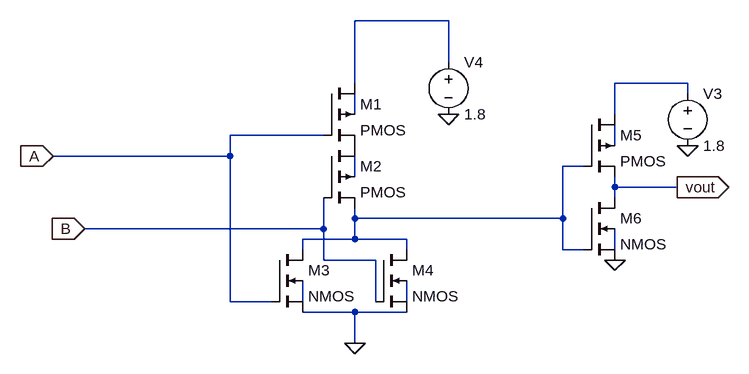
[diagram p0: schematic OR_Static.asc]
OR_Static.asc, the LTspice schematic file:
Version 4
SHEET 1 880 680
WIRE 304 -64 160 -64
WIRE 304 0 304 -64
WIRE 160 32 160 -64
WIRE 672 32 560 32
WIRE 672 48 672 32
WIRE 160 80 160 48
WIRE 560 80 560 32
WIRE 112 112 -32 112
WIRE 560 128 560 96
WIRE -32 144 -32 112
WIRE -32 144 -304 144
WIRE 512 160 480 160
WIRE 160 176 160 144
WIRE 560 192 560 176
WIRE 656 192 560 192
WIRE 560 208 560 192
WIRE 160 240 160 224
WIRE 480 240 480 160
WIRE 480 240 160 240
WIRE 112 256 112 208
WIRE 112 256 -256 256
WIRE 160 272 160 240
WIRE 160 272 80 272
WIRE 240 272 160 272
WIRE 80 288 80 272
WIRE 240 288 240 272
WIRE 480 288 480 240
WIRE 512 288 480 288
WIRE 560 288 560 256
WIRE 112 304 112 256
WIRE 192 304 112 304
WIRE -32 368 -32 144
WIRE 32 368 -32 368
WIRE 80 368 80 336
WIRE 192 368 192 304
WIRE 240 368 240 336
WIRE 160 384 80 384
WIRE 240 384 160 384
WIRE 160 432 160 384
FLAG 160 432 0
FLAG 560 304 0
FLAG 672 128 0
FLAG 304 80 0
FLAG 656 192 vout
IOPIN 656 192 Out
FLAG -304 144 A
IOPIN -304 144 In
FLAG -256 256 B
IOPIN -256 256 In
SYMBOL pmos4 112 32 R0
SYMATTR InstName M1
SYMBOL pmos4 112 128 R0
SYMATTR InstName M2
SYMBOL nmos4 32 288 R0
SYMATTR InstName M3
SYMBOL nmos4 192 288 R0
SYMATTR InstName M4
SYMBOL pmos4 512 80 R0
SYMATTR InstName M5
SYMBOL nmos4 512 208 R0
SYMATTR InstName M6
SYMBOL voltage 672 32 R0
WINDOW 123 0 0 Left 0
WINDOW 39 0 0 Left 0
SYMATTR InstName V3
SYMATTR Value 1.8
SYMBOL voltage 304 -16 R0
WINDOW 123 0 0 Left 0
WINDOW 39 0 0 Left 0
SYMATTR InstName V4
SYMATTR Value 1.8

The netlist it stands for:
* OR_Static.asc
M1 N001 A P001 N003 PMOS
M2 P001 B N005 N006 PMOS
M3 N005 A 0 N008 NMOS
M4 N005 B 0 N009 NMOS
M5 N002 N005 vout N004 PMOS
M6 vout N005 0 N007 NMOS
V3 N002 0 1.8
V4 N001 0 1.8
.model NMOS NMOS
.model PMOS PMOS
.lib standard.mos
.backanno
.end